# Altium schematic sheet Sheet1.SchDoc
size A4; SheetNumber: 1; SheetTotal: 1
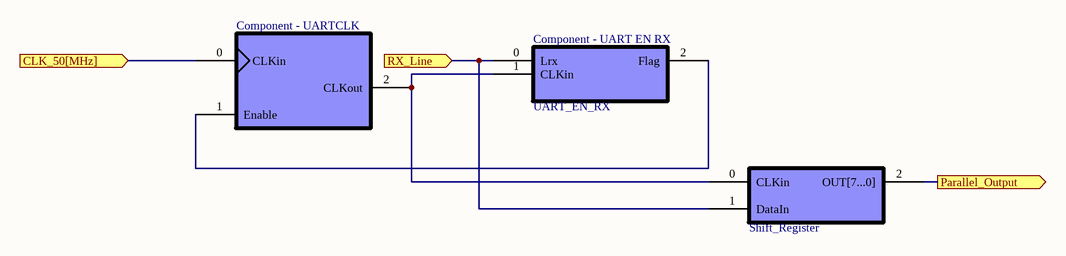
[diagram p0: Sheet1.SchDoc]

## Parts
(Parts that share a designator on the sheet are numbered #1, #2 ... from top to bottom, then left to right.)
*#1  UART_CLK  (value not drawn)
*#2  UART_EN_RX
*#3  Shift_Register

## Ports
CLK_50[MHz] (in), Parallel_Output (out), RX_Line (in)

## Nets
CLK_50[MHz]: *#1.0(CLKin) ; port CLK_50[MHz]
Parallel_Output: *#3.2(OUT[7...0]) ; port Parallel_Output
RX_Line: *#2.0(Lrx) *#3.1(DataIn) ; port RX_Line
Net*#1_1: *#1.1(Enable) *#2.2(Flag)
Net*#1_2: *#1.2(CLKout) *#2.1(CLKin) *#3.0(CLKin)

## Notes on the sheet
- (in symbol UART_CLK) Component - UARTCLK
- (in symbol UART_EN_RX) Component - UART EN RX